# Altium project Termal controller.PrjPcb
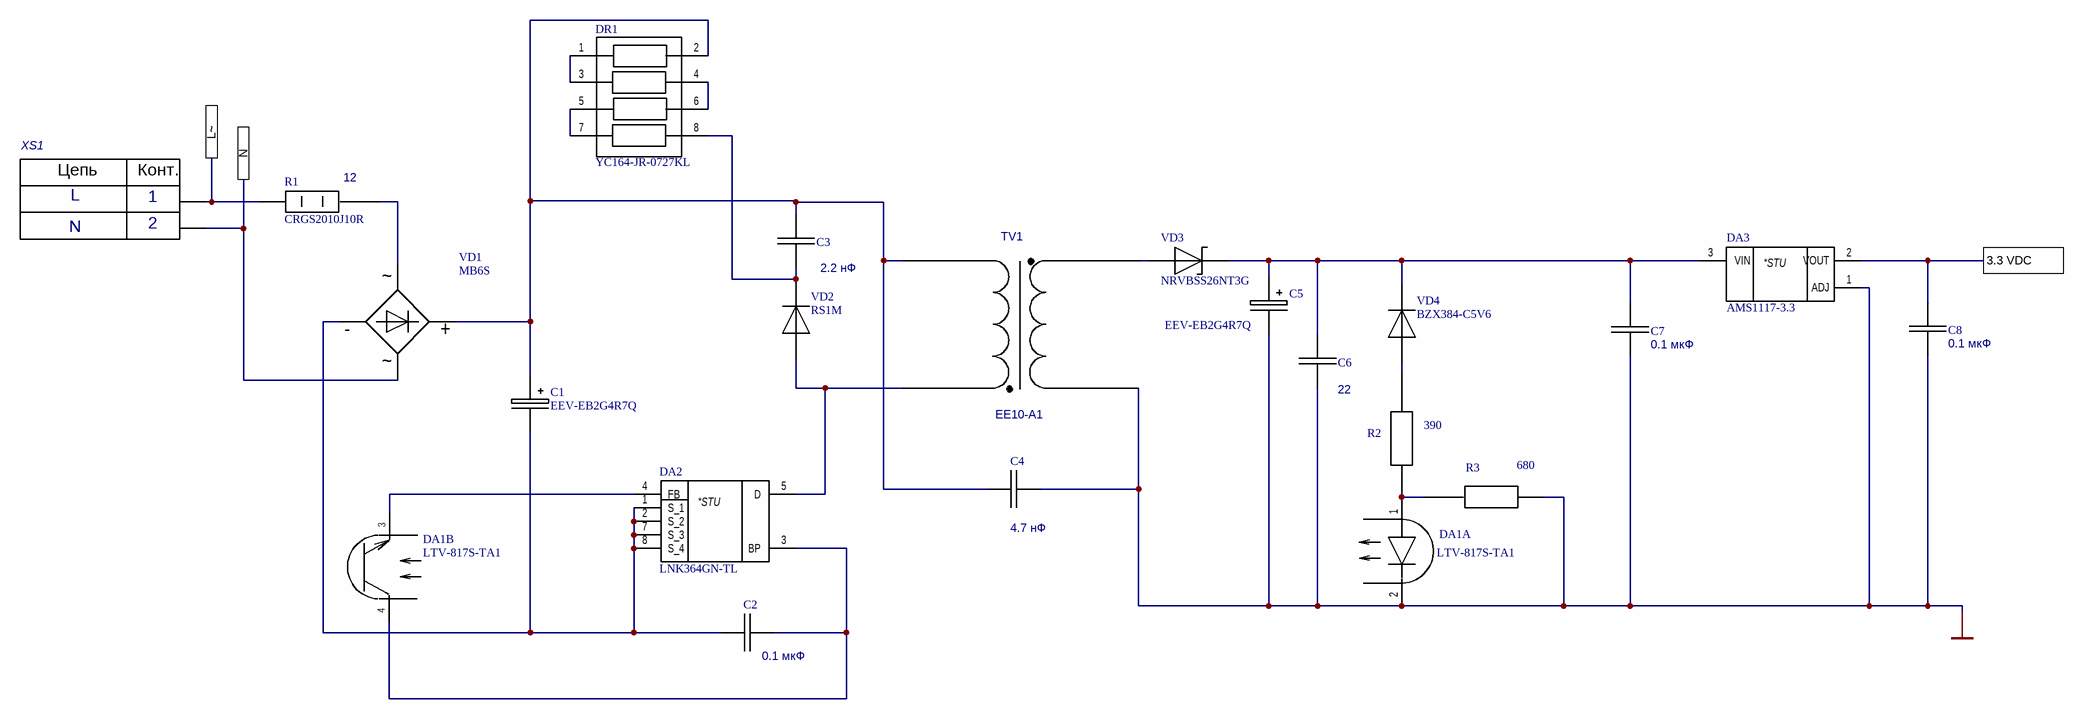
[diagram p0: Power.SchDoc]
DecimalNumber: ПИД-регулятор; Децимальный номер печатного узла: ПИД-регулятор; Код типа схемы: Э3; Компания: SkillBox; Наименование1: ПИД-регулятор печи оплавления; Наименование2: с программируемым термопрофилем; Обозначение: ПИД-регуляторЭ3; Папка для сохранения графической документации: Документация; Папка для сохранения текстовой документации: Документация; Разработал: Чурей С. К.; Тип документа: Схема электрическая принципиальная
2 sheets, 72 parts. Net scope: flat (ports and power ports of the same name join across sheets).
Board file: Termal controller.PcbDoc
Sheets:
  Power.SchDoc
  MCU.SchDoc

## Sheet Power.SchDoc
size 420 x 297 mm; SheetNumber: 1; SheetTotal: 2

### Parts
C1  EEV-EB2G4R7Q  [CAPAE1030X1700N]
C2  value 0.1 мкФ  [С0603]  (hidden comment: 06035C104JAT2A)
C3  value 2.2 нФ  [C1206]  (hidden comment: CC1206KKX7RBBB222)
C4  value 4.7 нФ  [B81123C1472M000]  (hidden comment: Конденсатор неполярный)
C5  EEV-EB2G4R7Q  [CAPAE1030X1700N]
C6  value 22  [C1206]  (hidden comment: CC1206KKX5R7BB226)
C7  value 0.1 мкФ  [С0603]  (hidden comment: 06035C104JAT2A)
C8  value 0.1 мкФ  [С0603]  (hidden comment: 06035C104JAT2A)
DA1  LTV-817S-TA1  [SOP254P1016X400-4N]  (parts A,B of 2)
DA2  LNK364GN-TL  [LNK364GNTL]
DA3  AMS1117-3.3  [SOT229P700X180-4N]
DR1  YC164-JR-0727KL  [CAT161000F4]
R1  CRGS2010J10R  value 12  [RESC5025X65N]
R2  value 390  [R0402]  (hidden comment: RC0402FR-07390RL)
R3  value 680  [R0402]  (hidden comment: RC0402FR-07680RL)
TV1  EE10-A1  [EE10-A1]
VD1  MB6S  [SOP250P700X190-4N]
VD2  RS1M  [DIOM5026X262N]
VD3  NRVBSS26NT3G  [DIOM5436X247N]
VD4  BZX384-C5V6  [SOD2512X110N]
XS1  S2B-PH-K-S  [ED350V-02P]  (value not drawn)

### Ports
3.3 VDC, L~, N

### Nets
DGND: C4.2 C5.2(-) C6.2 C7.1 C8.2 DA1.2(CATHODE) DA3.1(ADJ) R3.1 TV1.5
NetC1_1: C1.1(+) C3.1 C4.1 DR1.2 TV1.1(Vin) VD1.1(+)
NetC1_2: C1.2(-) C2.1 DA2.1(S_1) DA2.2(S_2) DA2.7(S_3) DA2.8(S_4) VD1.2(-)
NetC2_2: C2.2 DA1.4(C) DA2.3(BP)
NetC3_2: C3.2 DR1.8 VD2.1(K)
NetC5_1: C5.1(+) C6.1 C7.2 DA3.3(VIN) VD3.1(K) VD4.1(K)
NetC8_1: C8.1 DA3.2(VOUT) ; port 3.3 VDC
NetDA1_1: DA1.1(ANODE) R2.1 R3.2
NetDA1_3: DA1.3(E) DA2.4(FB)
NetDA2_5: DA2.5(D) TV1.4 VD2.2(A)
NetDR1_1: DR1.1 DR1.3
NetDR1_4: DR1.4 DR1.6
NetDR1_5: DR1.5 DR1.7
NetR1_1: R1.1 XS1.1 ; port L~
NetR1_2: R1.2 VD1.3
NetR2_2: R2.2 VD4.2(A)
NetTV1_8: TV1.8(Vout) VD3.2(A)
NetVD1_4: VD1.4 XS1.2 ; port N

### Notes on the sheet
- N
- L
- Перв. примен.
- Справ. №
- Подп. и дата
- Инв. № дубл.
- Взам. инв. №
- Разраб.
- Изм.
- Лист
- № докум.
- Подп.
- Дата
- Лит.
- Масса
- Масштаб
- Пров.
- Т. контр.
- Листов
- Инв. № подл.
- Н. контр.
- Утв.
- Копировал
- Формат А3
- (in symbol AMS1117-3.3) *STU
- (in symbol LNK364GN-TL) *STU
- (in symbol Разъем_1) Цепь; Конт.

### Library data of the parts
C1 = EEV-EB2G4R7Q: Capacitor Polarised; Manufacturer_Name: Panasonic; Datasheet Link: http://industrial.panasonic.com/cdbs/www-data/pdf/RDE0000/ABA0000C1202.pdf; Height: 17mm; Manufacturer_Part_Number: EEV-EB2G4R7Q; Mouser Part Number: 667-EEV-EB2G4R7Q; Mouser Price/Stock: https://www.mouser.co.uk/ProductDetail/Panasonic/EEV-EB2G4R7Q?qs=h4ONpho3ypMX7%2FLtZhu%252BqQ%3D%3D; Arrow Part Number: EEV-EB2G4R7Q; Arrow Price/Stock: https://www.arrow.com/en/products/eeveb2g4r7q/panasonic?region=nac
C2 C7 C8 = Конденсатор неполярный: Керамический ЧИП-конденсатор 0603 X7R 0.1мкФ ±5% 50В; Manufacturer_Name: KEMET; Manufacturer_Part_Number: CC0402KRX7R7BB222; Datasheet Link: https://componentsearchengine.com/Datasheets/34/CC0402KRX7R7BB222.pdf; Height: 0.55mm
C3 = Конденсатор неполярный: Керамический ЧИП-конденсатор 1206 X7R 2200пФ ±10% 500В; Manufacturer_Name: KEMET; Manufacturer_Part_Number: CC0402KRX7R7BB222; Datasheet Link: https://componentsearchengine.com/Datasheets/34/CC0402KRX7R7BB222.pdf; Height: 0.55mm
C4 = Конденсатор неполярный: Capacitor; Manufacturer_Name: KEMET; Manufacturer_Part_Number: CC0402KRX7R7BB222; Datasheet Link: https://componentsearchengine.com/Datasheets/34/CC0402KRX7R7BB222.pdf; Height: 0.55mm
C5 = Конденсатор полярный: Capacitor Polarised; Manufacturer_Name: Panasonic; Datasheet Link: http://industrial.panasonic.com/cdbs/www-data/pdf/RDE0000/ABA0000C1202.pdf; Height: 17mm; Manufacturer_Part_Number: EEV-EB2G4R7Q; Mouser Part Number: 667-EEV-EB2G4R7Q; Mouser Price/Stock: https://www.mouser.co.uk/ProductDetail/Panasonic/EEV-EB2G4R7Q?qs=h4ONpho3ypMX7%2FLtZhu%252BqQ%3D%3D; Arrow Part Number: EEV-EB2G4R7Q; Arrow Price/Stock: https://www.arrow.com/en/products/eeveb2g4r7q/panasonic?region=nac
C6 = Конденсатор неполярный: Керамический ЧИП-конденсатор 1206 X5R 22мкФ ±10% 16В; Manufacturer_Name: KEMET; Manufacturer_Part_Number: CC0402KRX7R7BB222; Datasheet Link: https://componentsearchengine.com/Datasheets/34/CC0402KRX7R7BB222.pdf; Height: 0.55mm
DA1 = LTV-817S-TA1: Integrated Circuit; Manufacturer_Name: Lite-On; Datasheet Link: http://optoelectronics.liteon.com/upload/download/DS-70-96-0016/LTV-8X7%20series%20201610%20.pdf; Height: 4mm; Manufacturer_Part_Number: LTV-817S-TA1; Mouser Part Number: 859-LTV-817S-TA1; Mouser Price/Stock: https://www.mouser.co.uk/ProductDetail/Lite-On/LTV-817S-TA1?qs=gnaPJ2cis705dA%252BrXNgReQ%3D%3D; Arrow Part Number: LTV-817S-TA1; Arrow Price/Stock: https://www.arrow.com/en/products/ltv-817s-ta1/lite-on-technology?utm_currency=USD&region=nac
DA2 = LNK364GN-TL: AC-DC контроллер; Manufacturer_Name: Power Integrations; Datasheet Link: https://www.power.com/sites/default/files/product-docs/lnk362-364.pdf; Height: 3.68mm; Manufacturer_Part_Number: LNK364GN-TL; Mouser Part Number: 869-LNK364GN-TL; Mouser Price/Stock: https://www.mouser.co.uk/ProductDetail/Power-Integrations/LNK364GN-TL?qs=Jph8NoUxIfUMH738%2FE3y8A%3D%3D
DA3 = AMS1117-3.3: Integrated Circuit; Manufacturer_Name: Advanced; Datasheet Link: https://datasheet.datasheetarchive.com/originals/distributors/Datasheets-28/DSA-550594.pdf; Height: 1.8mm; Manufacturer_Part_Number: AMS1117-3.3
DR1 = Резисторная сборка 4: Resistor Network; Manufacturer_Name: Bourns; Manufacturer_Part_Number: CAT16-2702F4LF; Value: 27K; Datasheet Link: https://bourns.com/docs/product-datasheets/catcay.pdf?sfvrsn=eae9f7ea_24; Height: 0.6mm; Mouser Part Number: 652-CAT16-2702F4LF; Mouser Price/Stock: http://www.mouser.com/Search/ProductDetail.aspx?qs=2cU%252bdy8NdRo19krE2bXLqQ%3d%3d; Arrow Part Number: CAT16-2702F4LF; Arrow Price/Stock: https://www.arrow.com/en/products/cat16-2702f4lf/bourns
R1 = CRGS2010J10R: Resistor; Manufacturer_Name: TE Connectivity; Datasheet Link: http://www.te.com/commerce/DocumentDelivery/DDEController?Action=showdoc&DocId=Data+Sheet%7F9-1773463-8%7FB%7Fpdf%7FEnglish%7FENG_DS_9-1773463-8_B.pdf%7F3-2176251-0; Height: 0.65mm; Manufacturer_Part_Number: CRGS2010J10R; Mouser Part Number: 279-CRGS2010J10R; Mouser Price/Stock: https://www.mouser.co.uk/ProductDetail/TE-Connectivity-Holsworthy/CRGS2010J10R?qs=Rv6LVDxB0ZqF0MPdEdt49w%3D%3D; Arrow Part Number: CRGS2010J10R; Arrow Price/Stock: https://www.arrow.com/en/products/crgs2010j10r/te-connectivity?utm_currency=USD&region=nac
R2 = Резистор: Толстопленочный ЧИП-резистор 0402 390Ом ±1% 0.063Вт -55°С...+155°С; Units: Ом
R3 = Резистор: олстопленочный ЧИП-резистор 0402 680Ом ±1% 0.063Вт -55°С...+155°С; Units: Ом
TV1 = EE10-A1: Импульсный трансформатор 220V; 5-12V; P=1-3W; 100-200kHz
VD1 = MB6S: Bridge Rectifier; Manufacturer_Name: Guangdong Hottech; Height: 1.9mm; Manufacturer_Part_Number: MB6S
VD2 = RS1M: Diode; Manufacturer_Name: Multicomp Pro; Datasheet Link: http://www.farnell.com/datasheets/2863960.pdf; Height: 2.62mm; Manufacturer_Part_Number: RS1M
VD3 = NRVBSS26NT3G: Schottky Diode; Manufacturer_Name: onsemi; Datasheet Link: https://www.onsemi.com/pub/Collateral/SS26-D.PDF; Height: 2.47mm; Manufacturer_Part_Number: NRVBSS26NT3G; Mouser Part Number: 863-NRVBSS26NT3G; Mouser Price/Stock: https://www.mouser.co.uk/ProductDetail/ON-Semiconductor/NRVBSS26NT3G/?qs=xZ%2FP%252Ba9zWqaNJTeScEpd%252Bw%3D%3D
VD4 = BZX384-C5V6: Diode; Manufacturer_Name: Nexperia; Datasheet Link: https://datasheet.datasheetarchive.com/originals/distributors/Datasheets-20/DSA-380039.pdf; Height: 1.1mm; Manufacturer_Part_Number: BZX384-C5V6; Mouser Part Number: N/A; Mouser Price/Stock: https://www.mouser.com/Search/Refine.aspx?Keyword=N%2FA
XS1 = Разъем_1: Гнездо провод-плата;; Value: *

## Sheet MCU.SchDoc
size 420 x 297 mm; SheetNumber: 2; SheetTotal: 2
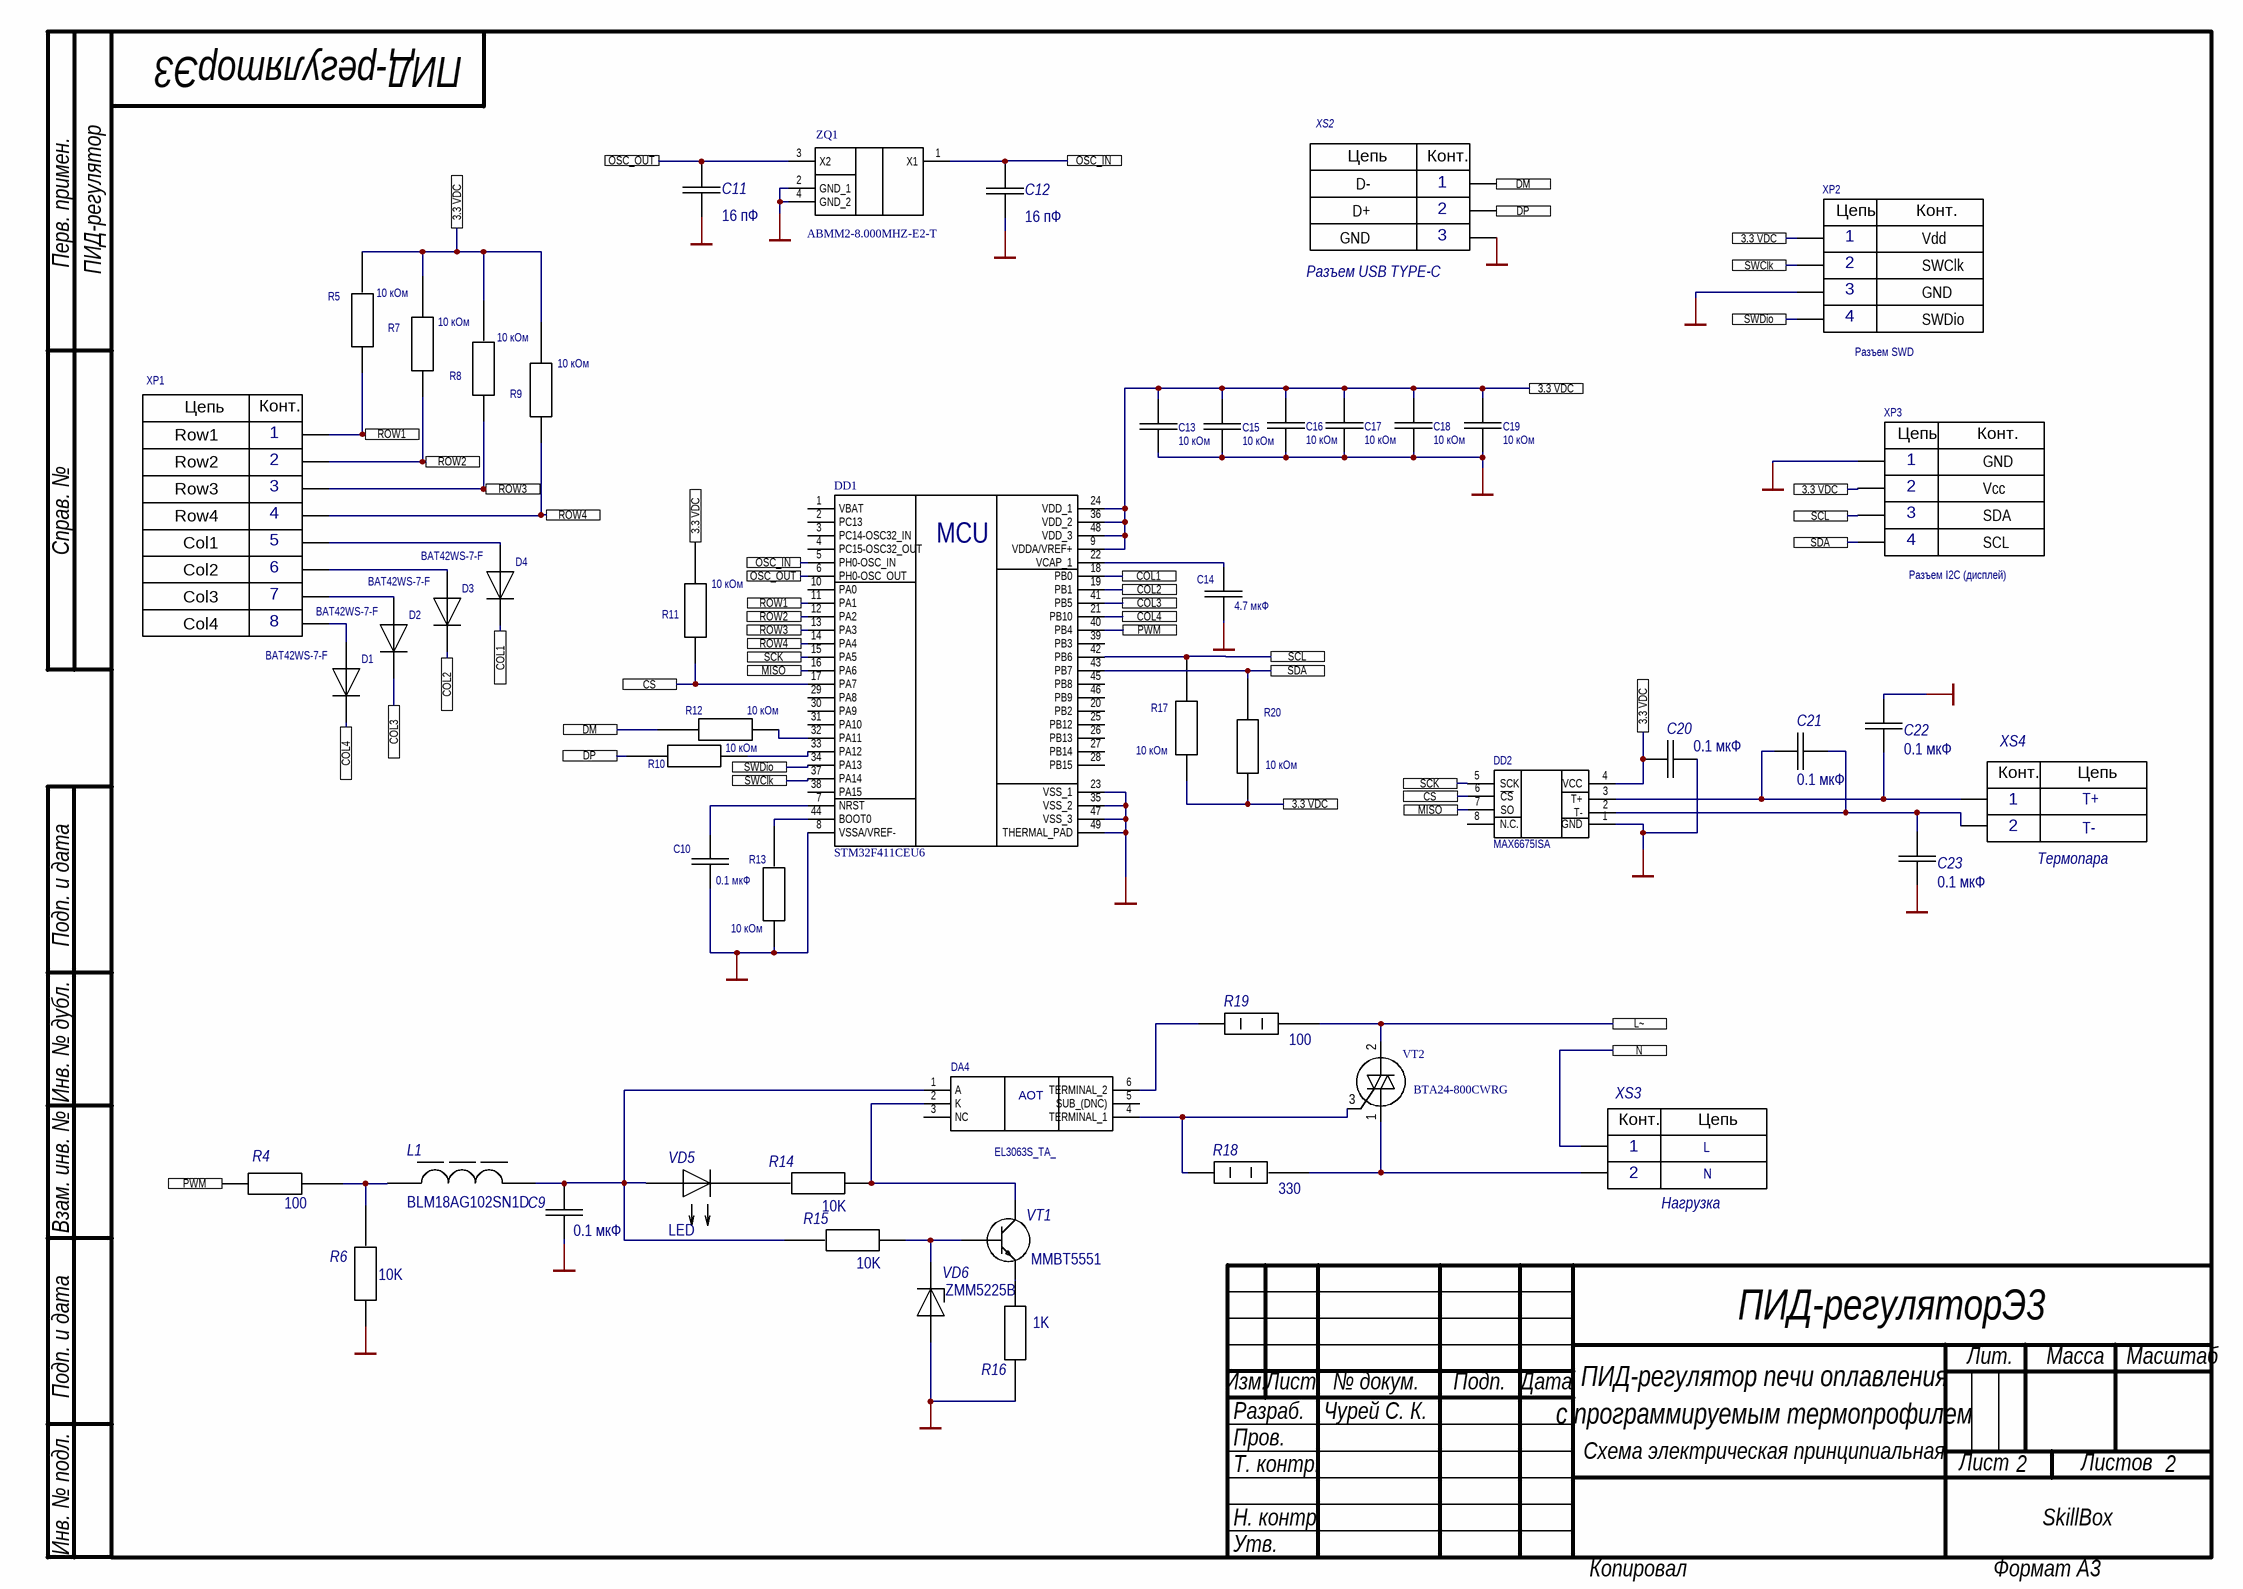
[diagram p1: MCU.SchDoc]

### Parts
C9  value 0.1 мкФ  [С0603]  (hidden comment: 06035C104JAT2A)
C10  value 0.1 мкФ  [С0603]  (hidden comment: 06035C104JAT2A)
C11  value 16 пФ  [C0402]  (hidden comment: CC0603JRNPO9BN160)
C12  value 16 пФ  [C0402]  (hidden comment: CC0603JRNPO9BN160)
C13  value 10 кОм  [С0603]  (hidden comment: 06035C104JAT2A)
C14  value 4.7 мкФ  [С0603]  (hidden comment: 06035C104JAT2A)
C15  value 10 кОм  [С0603]  (hidden comment: 06035C104JAT2A)
C16  value 10 кОм  [С0603]  (hidden comment: 06035C104JAT2A)
C17  value 10 кОм  [С0603]  (hidden comment: 06035C104JAT2A)
C18  value 10 кОм  [С0603]  (hidden comment: 06035C104JAT2A)
C19  value 10 кОм  [С0603]  (hidden comment: 06035C104JAT2A)
C20  value 0.1 мкФ  [С0603]  (hidden comment: 06035C104JAT2A)
C21  value 0.1 мкФ  [С0603]  (hidden comment: 06035C104JAT2A)
C22  value 0.1 мкФ  [С0603]  (hidden comment: 06035C104JAT2A)
C23  value 0.1 мкФ  [С0603]  (hidden comment: 06035C104JAT2A)
D1  BAT42WS-7-F  [SOD2513X120N]
D2  BAT42WS-7-F  [SOD2513X120N]
D3  BAT42WS-7-F  [SOD2513X120N]
D4  BAT42WS-7-F  [SOD2513X120N]
DA4  EL3063S_TA_  [SOP254P1030X460-6N]
DD1  STM32F411CEU6  [QFN50P700X700X60-49N-D]
DD2  MAX6675ISA  [SOIC127P600X175-8N]
L1  BLM18AG102SN1D  [BLM18SP221SN1B]
R4  value 100  [R0402]  (hidden comment: R0402)
R5  value 10 кОм  [R0402]  (hidden comment: R0402)
R6  value 10K  [R0402]  (hidden comment: R0402)
R7  value 10 кОм  [R0402]  (hidden comment: R0402)
R8  value 10 кОм  [R0402]  (hidden comment: R0402)
R9  value 10 кОм  [R0402]  (hidden comment: R0402)
R10  value 10 кОм  [R0402]  (hidden comment: R0402)
R11  value 10 кОм  [R0402]  (hidden comment: R0402)
R12  value 10 кОм  [R0402]  (hidden comment: R0402)
R13  value 10 кОм  [R0402]  (hidden comment: R0402)
R14  value 10K  [R0402]  (hidden comment: R0402)
R15  value 10K  [R0402]  (hidden comment: R0402)
R16  value 1K  [R0402]  (hidden comment: R0402)
R17  value 10 кОм  [R0402]  (hidden comment: R0402)
R18  value 330  [RESC5025X65N]  (hidden comment: RC2010JK-07330RL)
R19  value 100  [RESC5025X65N]  (hidden comment: RC2010FK-07100RL)
R20  value 10 кОм  [R0402]  (hidden comment: R0402)
VD5  LED  [LED Red 5 мм]
VD6  ZMM5225B  [TMMDB3TG]
VT1  MMBT5551  [MMBT5551]
VT2  BTA24-800CWRG  [TO255P460X1020X2005-3P]
XP1  PLS3  [PLS8]  (value not drawn)
XP2  Разъем SWD  [PLS4]
XP3  Разъем I2C (дисплей)  [PLS4]
XS2  Разъем USB TYPE-C  [Разъем USB TYPE-C, 1054500101]
XS3  Нагрузка  [ED350V-02P]
XS4  Термопара  [S2B-PH-K-S]
ZQ1  ABMM2-8.000MHZ-E2-T  [ABMM2]

### Ports
3.3 VDC, COL1, COL2, COL3, COL4, CS, DM, DP, L~, MISO, N, OSC_IN, OSC_OUT, PWM, ROW1, ROW2, ROW3, ROW4, SCK, SCL, SDA, SWClk, SWDio

### Nets
DGND: C9.1 C10.2 C11.2 C12.2 C13.1 C14.1 C15.1 C16.1 C17.1 C18.1 C19.1 C20.1 C22.2 C23.1 DD1.8(VSSA/VREF-) DD1.23(VSS_1) DD1.35(VSS_2) DD1.47(VSS_3) DD1.49(THERMAL_PAD) DD2.1(GND) R6.1 R13.1 R16.2 VD6.2(A) XP2.3(GND) XP3.1(GND) XS2.A1(GND) ZQ1.2(GND_1) ZQ1.4(GND_2)
NetC8_1: C13.2 C15.2 C16.2 C17.2 C18.2 C19.2 C20.2 DD1.9(VDDA/VREF+) DD1.24(VDD_1) DD1.36(VDD_2) DD1.48(VDD_3) DD2.4(VCC) R5.2 R7.2 R8.2 R9.2 R11.2 R17.1 R20.1 XP2.1(Vdd) XP3.2(Vcc) ; port 3.3 VDC
NetC9_2: C9.2 DA4.1(A) L1.2 R15.2 VD5.1(ANODE)
NetC10_1: C10.1 DD1.7(NRST)
NetC11_1: C11.1 DD1.6(PH0-OSC_OUT) ZQ1.3(X2) ; port OSC_OUT
NetC12_1: C12.1 DD1.5(PH0-OSC_IN) ZQ1.1(X1) ; port OSC_IN
NetC14_2: C14.2 DD1.22(VCAP_1)
NetC21_1: C21.1 C22.1 DD2.3(T+) XS4.1
NetC21_2: C21.2 C23.2 DD2.2(T-) XS4.2
NetD1_1: D1.1(K) DD1.21(PB10) ; port COL4
NetD1_2: D1.2(A) XP1.8(Col4)
NetD2_1: D2.1(K) DD1.41(PB5) ; port COL3
NetD2_2: D2.2(A) XP1.7(Col3)
NetD3_1: D3.1(K) DD1.19(PB1) ; port COL2
NetD3_2: D3.2(A) XP1.6(Col2)
NetD4_1: D4.1(K) DD1.18(PB0) ; port COL1
NetD4_2: D4.2(A) XP1.5(Col1)
NetDA4_2: DA4.2(K) R14.1 VT1.3(C)
NetDA4_4: DA4.4(TERMINAL_1) R18.1 VT2.3(G)
NetDA4_6: DA4.6(TERMINAL_2) R19.1
NetDD1_11: DD1.11(PA1) R5.1 XP1.1(Row1) ; port ROW1
NetDD1_12: DD1.12(PA2) R7.1 XP1.2(Row2) ; port ROW2
NetDD1_13: DD1.13(PA3) R8.1 XP1.3(Row3) ; port ROW3
NetDD1_14: DD1.14(PA4) R9.1 XP1.4(Row4) ; port ROW4
NetDD1_15: DD1.15(PA5) DD2.5(SCK) ; port SCK
NetDD1_16: DD1.16(PA6) DD2.7(SO) ; port MISO
NetDD1_17: DD1.17(PA7) DD2.6(~{CS}) R11.1 ; port CS
NetDD1_32: DD1.32(PA11) R12.1
NetDD1_33: DD1.33(PA12) R10.1
NetDD1_34: DD1.34(PA13) XP2.4(SWDio) ; port SWDio
NetDD1_37: DD1.37(PA14) XP2.2(SWClk) ; port SWClk
NetDD1_40: DD1.40(PB4) R4.1 ; port PWM
NetDD1_42: DD1.42(PB6) R17.2 XP3.3(SDA) ; port SCL
NetDD1_43: DD1.43(PB7) R20.2 XP3.4(SCL) ; port SDA
NetDD1_44: DD1.44(BOOT0) R13.2
NetL1_1: L1.1 R4.2 R6.2
NetR1_1: R19.2 VT2.2(A2) ; port L~
NetR10_2: R10.2 XS2.A6(D+) ; port DP
NetR12_2: R12.2 XS2.A7(D-) ; port DM
NetR14_2: R14.2 VD5.2(CATHODE)
NetR15_1: R15.1 VD6.1(K) VT1.1(B)
NetR16_1: R16.1 VT1.2(E)
NetR18_2: R18.2 VT2.1(A1) XS3.2
NetVD1_4: XS3.1 ; port N

Not connected (* = marked no-connect by the designer): DA4 3(NC) 5(SUB_(DNC)); DD1 1(VBAT) 2(PC13) 3(PC14-OSC32_IN) 4(PC15-OSC32_OUT) 10(PA0) 20(PB2) 25(PB12) 26(PB13) 27(PB14) 28(PB15) 29(PA8) 30(PA9) 31(PA10) 38(PA15) 39(PB3) 45(PB8) 46(PB9); DD2 8(N.C.)

### Notes on the sheet
- T-
- T+
- L
- N
- Перв. примен.
- Справ. №
- Подп. и дата
- Инв. № дубл.
- Взам. инв. №
- Разраб.
- Изм.
- Лист
- № докум.
- Подп.
- Дата
- Лит.
- Масса
- Масштаб
- Пров.
- Т. контр.
- Листов
- Инв. № подл.
- Н. контр.
- Утв.
- Копировал
- Формат А3
- (in symbol EL3063S_TA_) АОТ
- (in symbol PLS8) Цепь; Конт.
- (in symbol STM32F411CEU6) MCU
- (in symbol Разъем) Конт.; Цепь
- (in symbol Разъем I2C (4)) Цепь; Конт.
- (in symbol Разъем SWD) Цепь; Конт.
- (in symbol Разъем USB TYPE-C) Цепь; Конт.; 1; 2; 3

### Library data of the parts
C9 C20-C23 = Конденсатор неполярный: as C2 on sheet Power; Datasheet Link: https://componentsearchengine.com/Datasheets/34/CC0402KRX7R7BB222.pdf; Height: 0.55mm
C10 C13-C19 = Конденсатор неполярный: as C4 on sheet Power; Datasheet Link: https://componentsearchengine.com/Datasheets/34/CC0402KRX7R7BB222.pdf; Height: 0.55mm
C11 C12 = Конденсатор неполярный: 16пФ ±5% 50В; Manufacturer_Name: KEMET; Manufacturer_Part_Number: CC0402KRX7R7BB222; Datasheet Link: https://componentsearchengine.com/Datasheets/34/CC0402KRX7R7BB222.pdf; Height: 0.55mm
D1-D4 = BAT42WS-7-F: Diode; Manufacturer_Name: Diodes Incorporated; Datasheet Link: https://www.diodes.com//assets/Datasheets/ds30100.pdf; Height: 1.2mm; Manufacturer_Part_Number: BAT42WS-7-F; Mouser Part Number: 621-BAT42WS-F; Mouser Price/Stock: https://www.mouser.co.uk/ProductDetail/Diodes-Incorporated/BAT42WS-7-F?qs=m4hD82FvRu0XtK2r8jLwYA%3D%3D; Arrow Part Number: BAT42WS-7-F; Arrow Price/Stock: https://www.arrow.com/en/products/bat42ws-7-f/diodes-incorporated?utm_currency=USD&region=europe
DA4 = EL3063S_TA_: Integrated Circuit; Manufacturer_Name: Everlight; Manufacturer_Part_Number: EL3063S(TA); Datasheet Link: https://www.mouser.com/datasheet/2/143/EL303X_EL304X_EL306X_EL308X-515384.pdf; Height: 4.6mm; Mouser Part Number: 638-EL3063STA; Mouser Price/Stock: https://www.mouser.com/Search/Refine.aspx?Keyword=638-EL3063STA; Arrow Part Number: EL3063S(TA); Arrow Price/Stock: https://www.arrow.com/en/products/el3063s-ta/everlight-electronics
DD1 = STM32F411CEU6: Integrated Circuit; Manufacturer_Name: STMicroelectronics; Datasheet Link: https://www.st.com/resource/en/datasheet/stm32f411ce.pdf; Height: 0.6mm; Manufacturer_Part_Number: STM32F411CEU6; Mouser Part Number: 511-STM32F411CEU6; Mouser Price/Stock: https://www.mouser.co.uk/ProductDetail/STMicroelectronics/STM32F411CEU6?qs=pjMTYa9MTGV3ou31YBFa3g%3D%3D; Arrow Part Number: STM32F411CEU6; Arrow Price/Stock: https://www.arrow.com/en/products/stm32f411ceu6/stmicroelectronics?utm_currency=USD&region=nac
DD2 = MAX6675ISA: Integrated Circuit; Manufacturer_Name: Analog Devices; Datasheet Link: http://datasheets.maximintegrated.com/en/ds/MAX6675.pdf; Height: 1.75mm; Manufacturer_Part_Number: MAX6675ISA; Mouser Part Number: N/A; Mouser Price/Stock: https://www.mouser.com/Search/Refine.aspx?Keyword=N%2FA
L1 = BLM18AG102SN1D: Ferrite Bead; Manufacturer_Name: Murata Electronics; Datasheet Link: http://www.murata.com/~/media/webrenewal/support/library/catalog/products/emc/emifil/c31e.ashx?la=en-gb; Height: 0.95mm; Manufacturer_Part_Number: BLM18AG102SN1D; Mouser Part Number: 81-BLM11A102S; Mouser Price/Stock: https://www.mouser.co.uk/ProductDetail/Murata-Electronics/BLM18AG102SN1D?qs=b2kFoOhrN4V4XjRBmusv4w%3D%3D; Arrow Part Number: BLM18AG102SN1D; Arrow Price/Stock: https://www.arrow.com/en/products/blm18ag102sn1d/murata-manufacturing?utm_currency=USD&region=nac
R4-R17 R20 = Резистор: Units: Ом
R18 R19 = Резистор 2 Вт: Resistor; Manufacturer_Name: TE Connectivity; Manufacturer_Part_Number: CRGS2010J10R; Datasheet Link: http://www.te.com/commerce/DocumentDelivery/DDEController?Action=showdoc&DocId=Data+Sheet%7F9-1773463-8%7FB%7Fpdf%7FEnglish%7FENG_DS_9-1773463-8_B.pdf%7F3-2176251-0; Height: 0.65mm; Mouser Part Number: 279-CRGS2010J10R; Mouser Price/Stock: https://www.mouser.co.uk/ProductDetail/TE-Connectivity-Holsworthy/CRGS2010J10R?qs=Rv6LVDxB0ZqF0MPdEdt49w%3D%3D; Arrow Part Number: CRGS2010J10R; Arrow Price/Stock: https://www.arrow.com/en/products/crgs2010j10r/te-connectivity?utm_currency=USD&region=nac
VD6 = ZMM5225B: Diac; Manufacturer_Name: STMicroelectronics; Datasheet Link: https://www.st.com/resource/en/datasheet/tmmdb3tg.pdf; Height: 1.7mm; Manufacturer_Part_Number: TMMDB3TG; Mouser Part Number: 511-TMMDB3TG; Mouser Price/Stock: https://www.mouser.co.uk/ProductDetail/STMicroelectronics/TMMDB3TG?qs=lgHKUCmDFtju6xjvp%2FOseQ%3D%3D; Arrow Part Number: TMMDB3TG; Arrow Price/Stock: https://www.arrow.com/en/products/tmmdb3tg/stmicroelectronics?region=nac
VT1 = MMBT5551: Transistor BJT NPN; Manufacturer_Name: Guangdong Hottech; Datasheet Link: https://doc.hotking.com/wr/specification/specification-en/MMBT5551_SOT-23.pdf; Height: 1.15mm; Manufacturer_Part_Number: MMBT5551
VT2 = BTA24-800CWRG: Triac A; Manufacturer_Name: STMicroelectronics; Datasheet Link: http://www.st.com/content/ccc/resource/technical/document/datasheet/da/b9/e2/fa/76/a3/40/9b/CD00002264.pdf/files/CD00002264.pdf/jcr:content/translations/en.CD00002264.pdf; Height: 4.6mm; Manufacturer_Part_Number: BTA24-800CWRG; Mouser Part Number: 511-BTA24-800CW; Mouser Price/Stock: https://www.mouser.co.uk/ProductDetail/STMicroelectronics/BTA24-800CWRG?qs=J0fHR8QSRK8TBQKNN3f7Zg%3D%3D; Arrow Part Number: BTA24-800CWRG; Arrow Price/Stock: https://www.arrow.com/en/products/bta24-800cwrg/stmicroelectronics?utm_currency=USD&region=europe
XP1 = PLS8
XP3 = Разъем I2C (4)
XS2 = Разъем USB TYPE-C: 1054500101, Разъем USB TYPE-C, USB 3.1, розетка, 24 вывод(-ов), Поверхностный Монтаж, Прямой Угол, Molex; Value: *
XS3 XS4 = Разъем: Гнездо провод-плата;; Value: *
ZQ1 = ABMM2-8.000MHZ-E2-T: Crystal or Oscillator; Manufacturer_Name: ABRACON; Datasheet Link: https://abracon.com/Resonators/ABMM2.pdf; Height: 1.2mm; Manufacturer_Part_Number: ABMM2-8.000MHZ-E2-T; Mouser Part Number: 815-ABMM2-8-E2T; Mouser Price/Stock: https://www.mouser.co.uk/ProductDetail/ABRACON/ABMM2-8.000MHZ-E2-T?qs=m%252BUhWDcpCfaGlLHGChx47g%3D%3D; Arrow Part Number: ABMM2-8.000MHZ-E2-T; Arrow Price/Stock: https://www.arrow.com/en/products/abmm2-8.000mhz-e2-t/abracon?utm_currency=USD&region=nac

## Nets that join several sheets
DGND: Power (9 pins), MCU (29 pins)
NetC8_1: Power (C8.1 DA3.2), MCU (21 pins)
NetR1_1: Power (R1.1 XS1.1), MCU (R19.2 VT2.2)
NetVD1_4: Power (VD1.4 XS1.2), MCU (XS3.1)